# Altium schematic sheet Amplifier.SchDoc
size A3; PageSetup: Record=PageOptions|CenterHorizontal=True|CenterVertical=True|PrintScale=0.73|XCorrection=1.00|YCorrection=1.00|PrintKind=0|BorderSize=5000000|LeftOffset=0|BottomOffset=0|Orientation=2|PaperLength=1000|PaperWidth=1000|Scale=100|PaperSource=7|PrintQuality=-3|MediaType=1|DitherType=10|PrintScaleMode=1|PaperKind=A4|PaperIndex=9
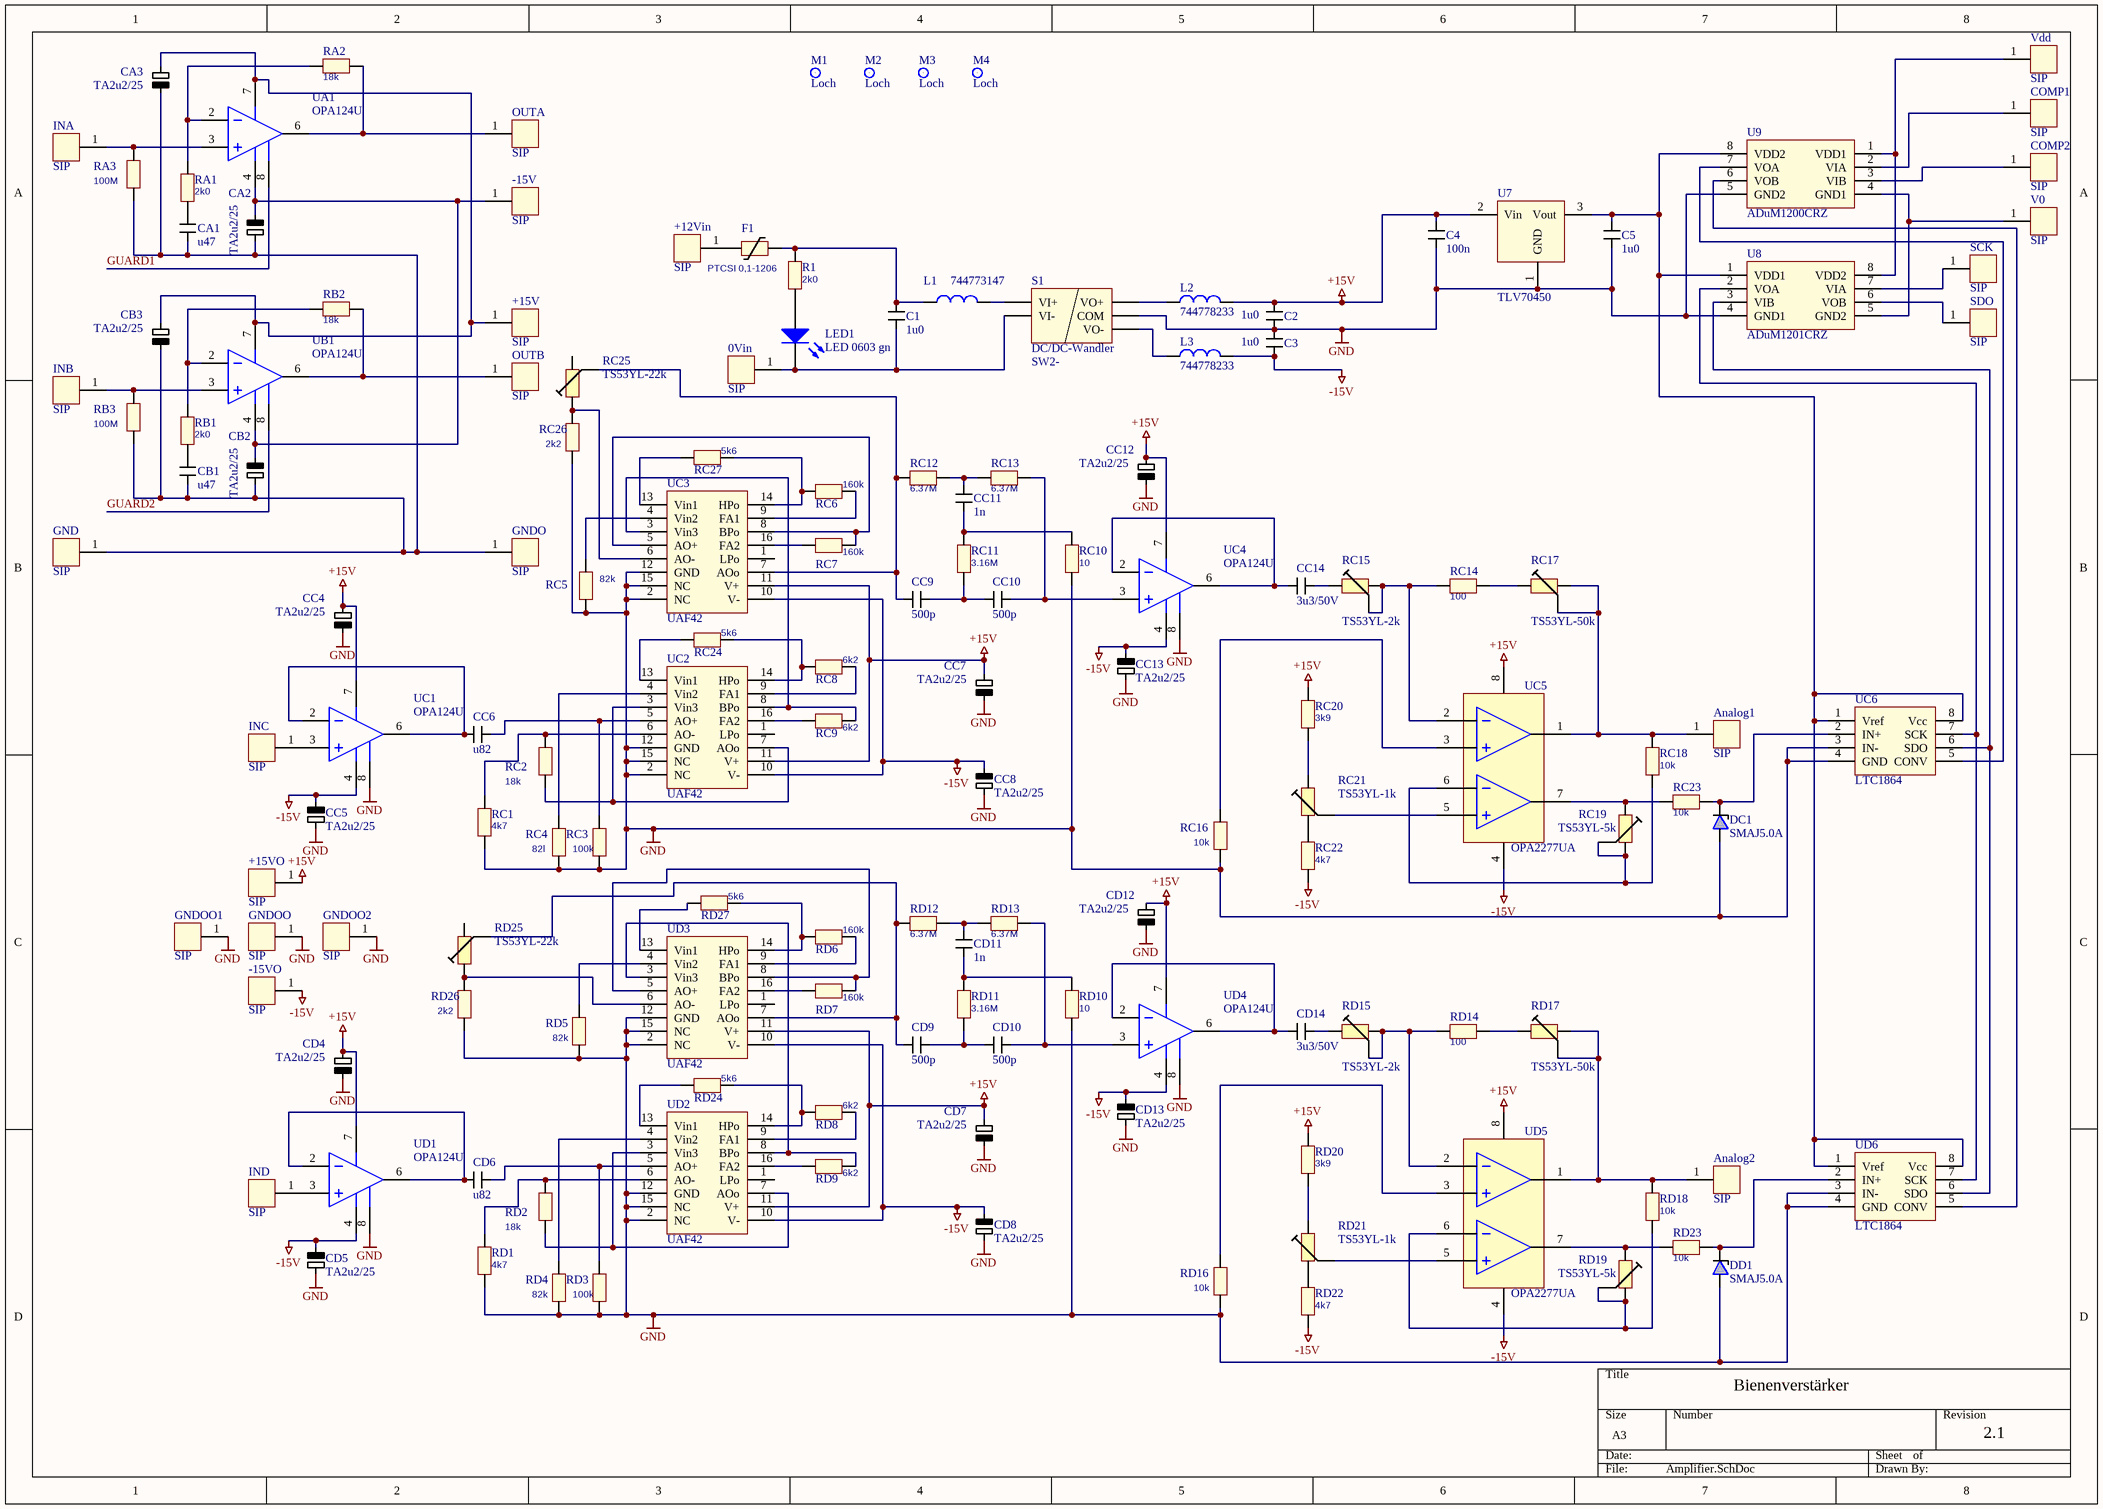
[diagram p0: Amplifier.SchDoc]

## Parts
0Vin  SIP  [PAD2,2x2,5]
+12Vin  SIP  [PAD2,2x2,5]
+15V  SIP  [PAD1X1]
+15VO  SIP  [PAD2,2x2,5]
-15V  SIP  [PAD1X1]
-15VO  SIP  [PAD2,2x2,5]
Analog1  SIP  [PAD2,2x2,5]
Analog2  SIP  [PAD2,2x2,5]
C1  1u0  [0603]
C2  1u0  [0603]
C3  1u0  [0603]
C4  100n  [0603]
C5  1u0  [0603]
CA1  u47  [0603]
CA2  TA2u2/25  [TA_SMD-A]
CA3  TA2u2/25  [TA_SMD-A]
CB1  u47  [0603]
CB2  TA2u2/25  [TA_SMD-A]
CB3  TA2u2/25  [TA_SMD-A]
CC4  TA2u2/25  [TA_SMD-A]
CC5  TA2u2/25  [TA_SMD-A]
CC6  u82  [C0805]
CC7  TA2u2/25  [TA_SMD-A]
CC8  TA2u2/25  [TA_SMD-A]
CC9  500p  [0603]
CC10  500p  [0603]
CC11  1n  [0603]
CC12  TA2u2/25  [TA_SMD-A]
CC13  TA2u2/25  [TA_SMD-A]
CC14  3u3/50V  [1206]
CD4  TA2u2/25  [TA_SMD-A]
CD5  TA2u2/25  [TA_SMD-A]
CD6  u82  [C0805]
CD7  TA2u2/25  [TA_SMD-A]
CD8  TA2u2/25  [TA_SMD-A]
CD9  500p  [0603]
CD10  500p  [0603]
CD11  1n  [0603]
CD12  TA2u2/25  [TA_SMD-A]
CD13  TA2u2/25  [TA_SMD-A]
CD14  3u3/50V  [1206]
COMP1  SIP  [PAD2,2x2,5]
COMP2  SIP  [PAD2,2x2,5]
DC1  SMAJ5.0A  [SMA (DO214AC)]
DD1  SMAJ5.0A  [SMA (DO214AC)]
F1  PTCSI 0,1-1206  [1206]
GND  SIP  [PAD1X1]
GNDO  SIP  [PAD1X1]
GNDOO  SIP  [PAD2,2x2,5]
GNDOO1  SIP  [PAD2,2x2,5]
GNDOO2  SIP  [PAD2,2x2,5]
INA  SIP  [PAD1X1]
INB  SIP  [PAD1X1]
INC  SIP  [PAD2,2x2,5]
IND  SIP  [PAD2,2x2,5]
L1  744773147  [WE-4045]
L2  744778233  [WE-PD S/M/XS]
L3  744778233  [WE-PD S/M/XS]
LED1  LED 0603 gn  [0603-Diode]
M1  value Loch  [MTHoleM3]  (hidden comment: MThole)
M2  value Loch  [MTHoleM3]  (hidden comment: MThole)
M3  value Loch  [MTHoleM3]  (hidden comment: MThole)
M4  value Loch  [MTHoleM3]  (hidden comment: MThole)
OUTA  SIP  [PAD1X1]
OUTB  SIP  [PAD1X1]
R1  2k0  [0603]
RA1  2k0  [0603]
RA2  18k  [0603]
RA3  100M  [0603]
RB1  2k0  [0603]
RB2  18k  [0603]
RB3  100M  [0603]
RC1  4k7  [0603]
RC2  18k  [0603]
RC3  100k  [0603]
RC4  82l  [0603]
RC5  82k  [0603]
RC6  160k  [0603]
RC7  160k  [0603]
RC8  6k2  [0603]
RC9  6k2  [0603]
RC10  10  [0603]
RC11  3.16M  [0603]
RC12  6.37M  [0603]
RC13  6.37M  [0603]
RC14  100  [0603]
RC15  TS53YL-2k  [TS53YL]
RC16  10k  [0603]
RC17  TS53YL-50k  [TS53YL]
RC18  10k  [0603]
RC19  TS53YL-5k  [TS53YL]
RC20  3k9  [0603]
RC21  TS53YL-1k  [TS53YL]
RC22  4k7  [0603]
RC23  10k  [0603]
RC24  5k6  [0603]
RC25  TS53YL-22k  [TS53YL]
RC26  2k2  [0603]
RC27  5k6  [0603]
RD1  4k7  [0603]
RD2  18k  [0603]
RD3  100k  [0603]
RD4  82k  [0603]
RD5  82k  [0603]
RD6  160k  [0603]
RD7  160k  [0603]
RD8  6k2  [0603]
RD9  6k2  [0603]
RD10  10  [0603]
RD11  3.16M  [0603]
RD12  6.37M  [0603]
RD13  6.37M  [0603]
RD14  100  [0603]
RD15  TS53YL-2k  [TS53YL]
RD16  10k  [0603]
RD17  TS53YL-50k  [TS53YL]
RD18  10k  [0603]
RD19  TS53YL-5k  [TS53YL]
RD20  3k9  [0603]
RD21  TS53YL-1k  [TS53YL]
RD22  4k7  [0603]
RD23  10k  [0603]
RD24  5k6  [0603]
RD25  TS53YL-22k  [TS53YL]
RD26  2k2  [0603]
RD27  5k6  [0603]
S1  DC/DC-Wandler  value SW2-  [DC/DC 2W Dual]
SCK  SIP  [PAD2,2x2,5]
SDO  SIP  [PAD2,2x2,5]
U7  TLV70450  [SOT23/5]
U8  ADuM1201CRZ  [SO8]
U9  ADuM1200CRZ  [SO8]
UA1  OPA124U  [SO8]
UB1  OPA124U  [SO8]
UC1  OPA124U  [SO8]
UC2  UAF42  [SO16W]
UC3  UAF42  [SO16W]
UC4  OPA124U  [SO8]
UC5  value OPA2277UA  [SO8]  (hidden comment: OPA2277)
UC6  LTC1864  [SO8]
UD1  OPA124U  [SO8]
UD2  UAF42  [SO16W]
UD3  UAF42  [SO16W]
UD4  OPA124U  [SO8]
UD5  value OPA2277UA  [SO8]  (hidden comment: OPA2277)
UD6  LTC1864  [SO8]
V0  SIP  [PAD2,2x2,5]
Vdd  SIP  [PAD2,2x2,5]

## Nets
+15V: +15VO.1 C2.2 C4.2 CC4.A CC7.A CC12.A CD4.A CD7.A CD12.A L2.2 RC20.1 RD20.1 U7.2(Vin) UC1.7(V+) UC2.11(V+) UC3.11(V+) UC4.7(V+) UC5.8(V+) UD1.7(V+) UD2.11(V+) UD3.11(V+) UD4.7(V+) UD5.8(V+)
-15V: -15VO.1 C3.1 CC5.C CC8.C CC13.C CD5.C CD8.C CD13.C L3.2 RC22.2 RD22.2 UC1.4(V-) UC2.10(V-) UC3.10(V-) UC4.4(V-) UC5.4(V-) UD1.4(V-) UD2.10(V-) UD3.10(V-) UD4.4(V-) UD5.4(V-)
GND: C2.1 C3.2 C4.1 C5.1 CC4.C CC5.A CC7.C CC8.A CC12.C CC13.A CD4.C CD5.A CD7.C CD8.A CD12.C CD13.A DC1.A DD1.A GNDOO.1 GNDOO1.1 GNDOO2.1 RC1.1 RC3.1 RC4.1 RC5.1 RC10.1 RC16.1 RC26.1 RD1.1 RD3.1 RD4.1 RD5.1 RD10.1 RD16.1 RD26.1 S1.COM U7.1(GND) U8.4(GND1) U9.5(GND2) UC1.8(Sub) UC2.2(NC) UC2.12(GND) UC2.15(NC) UC3.2(NC) UC3.12(GND) UC3.15(NC) UC4.8(Sub) UC6.3(IN-) UC6.4(GND) UD1.8(Sub) UD2.2(NC) UD2.12(GND) UD2.15(NC) UD3.2(NC) UD3.12(GND) UD3.15(NC) UD4.8(Sub) UD6.3(IN-) UD6.4(GND)
GUARD1: UA1.8(Sub)
GUARD2: UB1.8(Sub)
Net0Vin_1: 0Vin.1 C1.1 LED1.K S1.IM(VI-)
Net+12Vin_1: +12Vin.1 F1.1
Net+15V_1: +15V.1 CA3.A CB3.A UA1.7(V+) UB1.7(V+)
Net-15V_1: -15V.1 CA2.C CB2.C UA1.4(V-) UB1.4(V-)
NetAnalog1_1: Analog1.1 RC17.2 RC17.3 RC18.1 UC5.1(OUTA)
NetAnalog2_1: Analog2.1 RD17.2 RD17.3 RD18.1 UD5.1(OUTA)
NetC1_2: C1.2 F1.2 L1.1 R1.2
NetC5_2: C5.2 U7.3(Vout) U8.1(VDD1) U9.8(VDD2) UC6.1(Vref) UC6.8(Vcc) UD6.1(Vref) UD6.8(Vcc)
NetCA1_1: CA1.1 CA2.A CA3.C CB1.1 CB2.A CB3.C GND.1 GNDO.1 RA3.1 RB3.1
NetCA1_2: CA1.2 RA1.1
NetCB1_2: CB1.2 RB1.1
NetCC6_1: CC6.1 UC1.2(IN-) UC1.6(OUT)
NetCC6_2: CC6.2 RC3.2 UC2.5(AO+)
NetCC9_1: CC9.1 RC12.2 RC25.3 UC3.7(AOo)
NetCC9_2: CC9.2 CC10.1 RC11.1
NetCC10_2: CC10.2 RC13.1 UC4.3(IN+)
NetCC11_1: CC11.1 RC10.2 RC11.2
NetCC11_2: CC11.2 RC12.1 RC13.2
NetCC14_1: CC14.1 UC4.2(IN-) UC4.6(OUT)
NetCC14_2: CC14.2 RC15.1
NetCD6_1: CD6.1 UD1.2(IN-) UD1.6(OUT)
NetCD6_2: CD6.2 RD3.2 UD2.5(AO+)
NetCD9_1: CD9.1 RD12.2 RD25.3 UD3.7(AOo)
NetCD9_2: CD9.2 CD10.1 RD11.1
NetCD10_2: CD10.2 RD13.1 UD4.3(IN+)
NetCD11_1: CD11.1 RD10.2 RD11.2
NetCD11_2: CD11.2 RD12.1 RD13.2
NetCD14_1: CD14.1 UD4.2(IN-) UD4.6(OUT)
NetCD14_2: CD14.2 RD15.1
NetCOMP1_1: COMP1.1 U9.2(VIA)
NetCOMP2_1: COMP2.1 U9.3(VIB)
NetDC1_K: DC1.K RC23.2 UC6.2(IN+)
NetDD1_K: DD1.K RD23.2 UD6.2(IN+)
NetINA_1: INA.1 RA3.2 UA1.3(IN+)
NetINB_1: INB.1 RB3.2 UB1.3(IN+)
NetINC_1: INC.1 UC1.3(IN+)
NetIND_1: IND.1 UD1.3(IN+)
NetL1_2: L1.2 S1.IP(VI+)
NetL2_1: L2.1 S1.OP(VO+)
NetL3_1: L3.1 S1.OM(VO-)
NetLED1_A: LED1.A R1.1
NetOUTA_1: OUTA.1 RA2.2 UA1.6(OUT)
NetOUTB_1: OUTB.1 RB2.2 UB1.6(OUT)
NetRA1_2: RA1.2 RA2.1 UA1.2(IN-)
NetRB1_2: RB1.2 RB2.1 UB1.2(IN-)
NetRC1_2: RC1.2 RC2.2 UC2.6(AO-)
NetRC2_1: RC2.1 UC2.3(Vin3) UC2.7(AOo)
NetRC4_2: RC4.2 UC2.4(Vin2)
NetRC5_2: RC5.2 UC3.4(Vin2)
NetRC6_1: RC6.1 UC3.9(FA1)
NetRC6_2: RC6.2 RC27.1 UC3.14(HPo)
NetRC7_1: RC7.1 UC3.5(AO+) UC3.8(BPo)
NetRC7_2: RC7.2 UC3.16(FA2)
NetRC8_1: RC8.1 UC2.9(FA1)
NetRC8_2: RC8.2 RC24.1 UC2.14(HPo)
NetRC9_1: RC9.1 UC2.8(BPo) UC3.3(Vin3)
NetRC9_2: RC9.2 UC2.16(FA2)
NetRC14_1: RC14.1 RC17.1
NetRC14_2: RC14.2 RC15.2 RC15.3 UC5.2(INA-)
NetRC16_2: RC16.2 UC5.3(INA+)
NetRC18_2: RC18.2 RC19.2 RC19.3 UC5.6(INB-)
NetRC19_1: RC19.1 RC23.1 UC5.7(OUTB)
NetRC20_2: RC20.2 RC21.1
NetRC21_2: RC21.2 RC22.1
NetRC21_3: RC21.3 UC5.5(INB+)
NetRC24_2: RC24.2 UC2.13(Vin1)
NetRC25_1: RC25.1 RC26.2 UC3.6(AO-)
NetRC27_2: RC27.2 UC3.13(Vin1)
NetRD1_2: RD1.2 RD2.2 UD2.6(AO-)
NetRD2_1: RD2.1 UD2.3(Vin3) UD2.7(AOo)
NetRD4_2: RD4.2 UD2.4(Vin2)
NetRD5_2: RD5.2 UD3.4(Vin2)
NetRD6_1: RD6.1 UD3.9(FA1)
NetRD6_2: RD6.2 RD27.1 UD3.14(HPo)
NetRD7_1: RD7.1 UD3.5(AO+) UD3.8(BPo)
NetRD7_2: RD7.2 UD3.16(FA2)
NetRD8_1: RD8.1 UD2.9(FA1)
NetRD8_2: RD8.2 RD24.1 UD2.14(HPo)
NetRD9_1: RD9.1 UD2.8(BPo) UD3.3(Vin3)
NetRD9_2: RD9.2 UD2.16(FA2)
NetRD14_1: RD14.1 RD17.1
NetRD14_2: RD14.2 RD15.2 RD15.3 UD5.2(INA-)
NetRD16_2: RD16.2 UD5.3(INA+)
NetRD18_2: RD18.2 RD19.2 RD19.3 UD5.6(INB-)
NetRD19_1: RD19.1 RD23.1 UD5.7(OUTB)
NetRD20_2: RD20.2 RD21.1
NetRD21_2: RD21.2 RD22.1
NetRD21_3: RD21.3 UD5.5(INB+)
NetRD24_2: RD24.2 UD2.13(Vin1)
NetRD25_1: RD25.1 RD26.2 UD3.6(AO-)
NetRD27_2: RD27.2 UD3.13(Vin1)
NetSCK_1: SCK.1 U8.7(VIA)
NetSDO_1: SDO.1 U8.6(VOB)
NetU8_2: U8.2(VOA) UC6.7(SCK) UD6.7(SCK)
NetU8_3: U8.3(VIB) UC6.6(SDO) UD6.6(SDO)
NetU8_5: U8.5(GND2) U9.4(GND1) V0.1
NetU8_8: U8.8(VDD2) U9.1(VDD1) Vdd.1
NetU9_6: U9.6(VOB) UD6.5(CONV)
NetU9_7: U9.7(VOA) UC6.5(CONV)

Not connected (* = marked no-connect by the designer): M1 1; M2 1; M3 1; M4 1; RC25 2; RD25 2; UC2 1(LPo); UC3 1(LPo); UD2 1(LPo); UD3 1(LPo)

## Notes on the sheet
- Bienenverstärker
- 2.1

## Library data of the parts
0Vin +12Vin +15V +15VO -15V -15VO Analog1 Analog2 COMP1 COMP2 GND GNDO GNDOO GNDOO1 GNDOO2 INA INB INC IND OUTA OUTB SCK SDO V0 Vdd = SIP1: 2-pol. Leiste; Value: SIP
C1-C5 CA1 CB1 CC6 CC9-CC11 CC14 CD6 CD9-CD11 CD14 = Capacitor
  C1-C3 C5: Value: 1u0
  C4: Value: 100n
  CA1 CB1: Value: u47
  CC6 CD6: Value: u82
  CC9 CC10 CD9 CD10: Value: 500p
  CC11 CD11: Value: 1n
  CC14 CD14: Value: 3u3/50V
CA2 CA3 CB2 CB3 CC4 CC5 CC7 CC8 CC12 CC13 CD4 CD5 CD7 CD8 CD12 CD13 = Elko: Value: TA2u2/25
DC1 DD1 = DIODE TRANSIL: Value: SMAJ5.0A
F1 = Multifuse: Value: PTCSI 0,1-1206
L1-L3 = Inductor
  L1: Value: 744773147
  L2 L3: Value: 744778233
LED1 = LED: Typical RED, GREEN, YELLOW, AMBER GaAs LED; Published: 8-Jun-2000; LatestRevisionDate: 17-Jul-2002; LatestRevisionNote: Re-released for DXP Platform.; PackageDocument: Feb-2002; PackageReference: 3.2X1.6X1.1; Publisher: Altium Limited; Value: LED 0603 gn
M1-M4 = MTHoleM3: Befestigungsloch M3
R1 RA1-RA3 RB1-RB3 RC1-RC14 RC16 RC18 RC20 RC22-RC24 RC26 RC27 RD1-RD14 RD16 RD18 RD20 RD22-RD24 RD26 RD27 = Resistor
  R1 RA1 RB1: Value: 2k0
  RA2 RB2 RC2 RD2: Value: 18k
  RA3 RB3: Value: 100M
  RC1 RC22 RD1 RD22: Value: 4k7
  RC3 RD3: Value: 100k
  RC4: Value: 82l
  RC5 RD4 RD5: Value: 82k
  RC6 RC7 RD6 RD7: Value: 160k
  RC8 RC9 RD8 RD9: Value: 6k2
  RC10 RD10: Value: 10
  RC11 RD11: Value: 3.16M
  RC12 RC13 RD12 RD13: Value: 6.37M
  RC14 RD14: Value: 100
  RC16 RC18 RC23 RD16 RD18 RD23: Value: 10k
  RC20 RD20: Value: 3k9
  RC24 RC27 RD24 RD27: Value: 5k6
  RC26 RD26: Value: 2k2
RC15 RC17 RC19 RC21 RC25 RD15 RD17 RD19 RD21 RD25 = Trimmer
  RC15 RD15: Value: TS53YL-2k
  RC17 RD17: Value: TS53YL-50k
  RC19 RD19: Value: TS53YL-5k
  RC21 RD21: Value: TS53YL-1k
  RC25 RD25: Value: TS53YL-22k
S1 = DC/DC dual: DC/DC-Wandler Dual output
U7 = TLV704xx: VReg GND-IN_OUT; Value: TLV70450
U8 = ADuM1201/3211: Value: ADuM1201CRZ
U9 = ADuM1200: Value: ADuM1200CRZ
UA1 UB1 UC1 UC4 UD1 UD4 = OPA124U: Single General-Purpose, Low-Voltage Rail-to-Rail Output Operational Amplifier; Value: OPA124U
UC5 UD5 = LTC6244: Single General-Purpose, Low-Voltage Rail-to-Rail Output Operational Amplifier